# Altium project 数粒机发射板2通道.PrjPCB
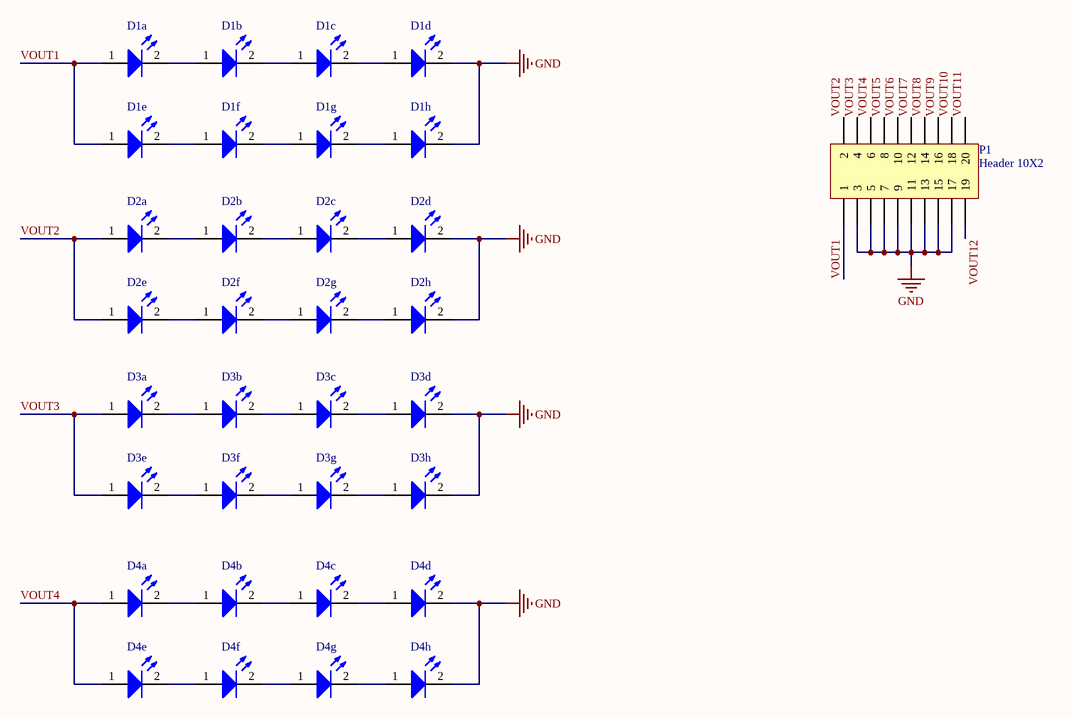
[diagram p0: 数粒机发射板2通道.SchDoc]
1 sheet, 33 parts. Net scope: global (net labels, ports and power ports of the same name join across sheets).
Board file: 数粒机发射板2通道.PcbDoc

## Sheet 数粒机发射板2通道.SchDoc
size A1

### Parts
D1a  红外接收珠子  [EL-1KL3]  (value not drawn)
D1b  红外接收珠子  [EL-1KL3]  (value not drawn)
D1c  红外接收珠子  [EL-1KL3]  (value not drawn)
D1d  红外接收珠子  [EL-1KL3]  (value not drawn)
D1e  红外接收珠子  [EL-1KL3]  (value not drawn)
D1f  红外接收珠子  [EL-1KL3]  (value not drawn)
D1g  红外接收珠子  [EL-1KL3]  (value not drawn)
D1h  红外接收珠子  [EL-1KL3]  (value not drawn)
D2a  红外接收珠子  [EL-1KL3]  (value not drawn)
D2b  红外接收珠子  [EL-1KL3]  (value not drawn)
D2c  红外接收珠子  [EL-1KL3]  (value not drawn)
D2d  红外接收珠子  [EL-1KL3]  (value not drawn)
D2e  红外接收珠子  [EL-1KL3]  (value not drawn)
D2f  红外接收珠子  [EL-1KL3]  (value not drawn)
D2g  红外接收珠子  [EL-1KL3]  (value not drawn)
D2h  红外接收珠子  [EL-1KL3]  (value not drawn)
D3a  红外接收珠子  [EL-1KL3]  (value not drawn)
D3b  红外接收珠子  [EL-1KL3]  (value not drawn)
D3c  红外接收珠子  [EL-1KL3]  (value not drawn)
D3d  红外接收珠子  [EL-1KL3]  (value not drawn)
D3e  红外接收珠子  [EL-1KL3]  (value not drawn)
D3f  红外接收珠子  [EL-1KL3]  (value not drawn)
D3g  红外接收珠子  [EL-1KL3]  (value not drawn)
D3h  红外接收珠子  [EL-1KL3]  (value not drawn)
D4a  红外接收珠子  [EL-1KL3]  (value not drawn)
D4b  红外接收珠子  [EL-1KL3]  (value not drawn)
D4c  红外接收珠子  [EL-1KL3]  (value not drawn)
D4d  红外接收珠子  [EL-1KL3]  (value not drawn)
D4e  红外接收珠子  [EL-1KL3]  (value not drawn)
D4f  红外接收珠子  [EL-1KL3]  (value not drawn)
D4g  红外接收珠子  [EL-1KL3]  (value not drawn)
D4h  红外接收珠子  [EL-1KL3]  (value not drawn)
P1  Header 10X2  [niujiaocha20p]

### Nets
GND: D1d.2(K) D1h.2(K) D2d.2(K) D2h.2(K) D3d.2(K) D3h.2(K) D4d.2(K) D4h.2(K) P1.3 P1.5 P1.7 P1.9 P1.11 P1.13 P1.15 P1.17
VOUT1: D1a.1(A) D1e.1(A) P1.1
VOUT2: D2a.1(A) D2e.1(A) P1.2
VOUT3: D3a.1(A) D3e.1(A) P1.4
VOUT4: D4a.1(A) D4e.1(A) P1.6
VOUT5: P1.8
VOUT6: P1.10
VOUT7: P1.12
VOUT8: P1.14
VOUT9: P1.16
VOUT10: P1.18
VOUT11: P1.20
VOUT12: P1.19
NetD1a_2: D1a.2(K) D1b.1(A)
NetD1b_2: D1b.2(K) D1c.1(A)
NetD1c_2: D1c.2(K) D1d.1(A)
NetD1e_2: D1e.2(K) D1f.1(A)
NetD1f_2: D1f.2(K) D1g.1(A)
NetD1g_2: D1g.2(K) D1h.1(A)
NetD2a_2: D2a.2(K) D2b.1(A)
NetD2b_2: D2b.2(K) D2c.1(A)
NetD2c_2: D2c.2(K) D2d.1(A)
NetD2e_2: D2e.2(K) D2f.1(A)
NetD2f_2: D2f.2(K) D2g.1(A)
NetD2g_2: D2g.2(K) D2h.1(A)
NetD3a_2: D3a.2(K) D3b.1(A)
NetD3b_2: D3b.2(K) D3c.1(A)
NetD3c_2: D3c.2(K) D3d.1(A)
NetD3e_2: D3e.2(K) D3f.1(A)
NetD3f_2: D3f.2(K) D3g.1(A)
NetD3g_2: D3g.2(K) D3h.1(A)
NetD4a_2: D4a.2(K) D4b.1(A)
NetD4b_2: D4b.2(K) D4c.1(A)
NetD4c_2: D4c.2(K) D4d.1(A)
NetD4e_2: D4e.2(K) D4f.1(A)
NetD4f_2: D4f.2(K) D4g.1(A)
NetD4g_2: D4g.2(K) D4h.1(A)

### Library data of the parts
D1a D1b D1c D1d D1e D1f D1g D1h D2a D2b D2c D2d D2e D2f D2g D2h D3a D3b D3c D3d D3e D3f D3g D3h D4a D4b D4c D4d D4e D4f D4g D4h = LED0: EL-1KL3; Published: 8-Jun-2000; LatestRevisionDate: 08-Jul-2005; LatestRevisionNote: Mech Layer 1 removed.; PackageReference: LED-0; Publisher: Altium Limited
P1 = Header 10X2: Header, 10-Pin, Dual row; LatestRevisionDate: 17-Jul-2002; LatestRevisionNote: Re-released for DXP Platform.; Publisher: Altium Limited